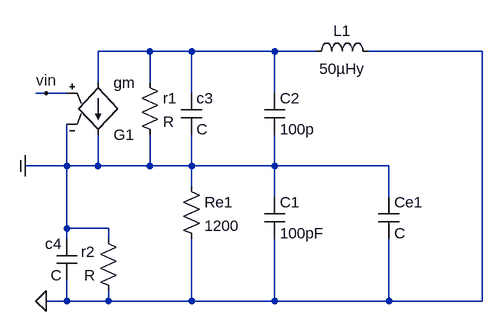
[diagram p0: schematic Collpits_f.asc]
Collpits_f.asc, the LTspice schematic file:
Version 4
SHEET 1 880 680
WIRE 0 -32 -80 -32
WIRE 64 -32 0 -32
WIRE 192 -32 64 -32
WIRE 256 -32 192 -32
WIRE 512 -32 336 -32
WIRE -80 16 -80 -32
WIRE 0 16 0 -32
WIRE -160 32 -176 32
WIRE -128 32 -160 32
WIRE 64 32 64 -32
WIRE 192 32 192 -32
WIRE -128 144 -128 80
WIRE -128 144 -192 144
WIRE -80 144 -80 96
WIRE -80 144 -128 144
WIRE 0 144 0 96
WIRE 0 144 -80 144
WIRE 64 144 64 96
WIRE 64 144 0 144
WIRE 192 144 192 96
WIRE 192 144 64 144
WIRE 368 144 192 144
WIRE 64 176 64 144
WIRE 192 192 192 144
WIRE 368 192 368 144
WIRE -128 240 -128 144
WIRE -64 240 -128 240
WIRE -128 256 -128 240
WIRE -64 256 -64 240
WIRE -128 352 -128 320
WIRE -128 352 -160 352
WIRE -64 352 -64 336
WIRE -64 352 -128 352
WIRE 64 352 64 256
WIRE 64 352 -64 352
WIRE 192 352 192 256
WIRE 192 352 64 352
WIRE 368 352 368 256
WIRE 368 352 192 352
WIRE 512 352 512 -32
WIRE 512 352 368 352
FLAG -160 352 0
FLAG -160 32 vin
FLAG -192 144 COM
SYMBOL ind 240 -16 R270
WINDOW 0 32 56 VTop 2
WINDOW 3 5 56 VBottom 2
SYMATTR InstName L1
SYMATTR Value 50µHy
SYMBOL res 48 160 R0
SYMATTR InstName Re1
SYMATTR Value 1200
SYMBOL cap 176 192 R0
SYMATTR InstName C1
SYMATTR Value 100pF
SYMBOL cap 176 32 R0
SYMATTR InstName C2
SYMATTR Value 100p
SYMBOL cap 352 192 R0
SYMATTR InstName Ce1
SYMBOL cap 48 32 R0
SYMATTR InstName c3
SYMBOL res -16 0 R0
SYMATTR InstName r1
SYMBOL g2 -80 112 M180
SYMATTR InstName G1
SYMATTR Value gm
SYMBOL cap -112 320 R180
WINDOW 0 24 56 Left 2
WINDOW 3 24 8 Left 2
SYMATTR InstName c4
SYMBOL res -48 352 R180
WINDOW 0 36 76 Left 2
WINDOW 3 36 40 Left 2
SYMATTR InstName r2

The netlist it stands for:
* Collpits_f.asc
L1 N001 0 50µHy
Re1 COM 0 1200
C1 COM 0 100pF
C2 N001 COM 100p
Ce1 COM 0 C
c3 N001 COM C
r1 N001 COM R
G1 N001 COM vin COM gm
c4 0 COM C
r2 0 COM R
.backanno
.end